# Altium schematic sheet QCLogic Rev A Sht2 WiFi.SchDoc
size A4
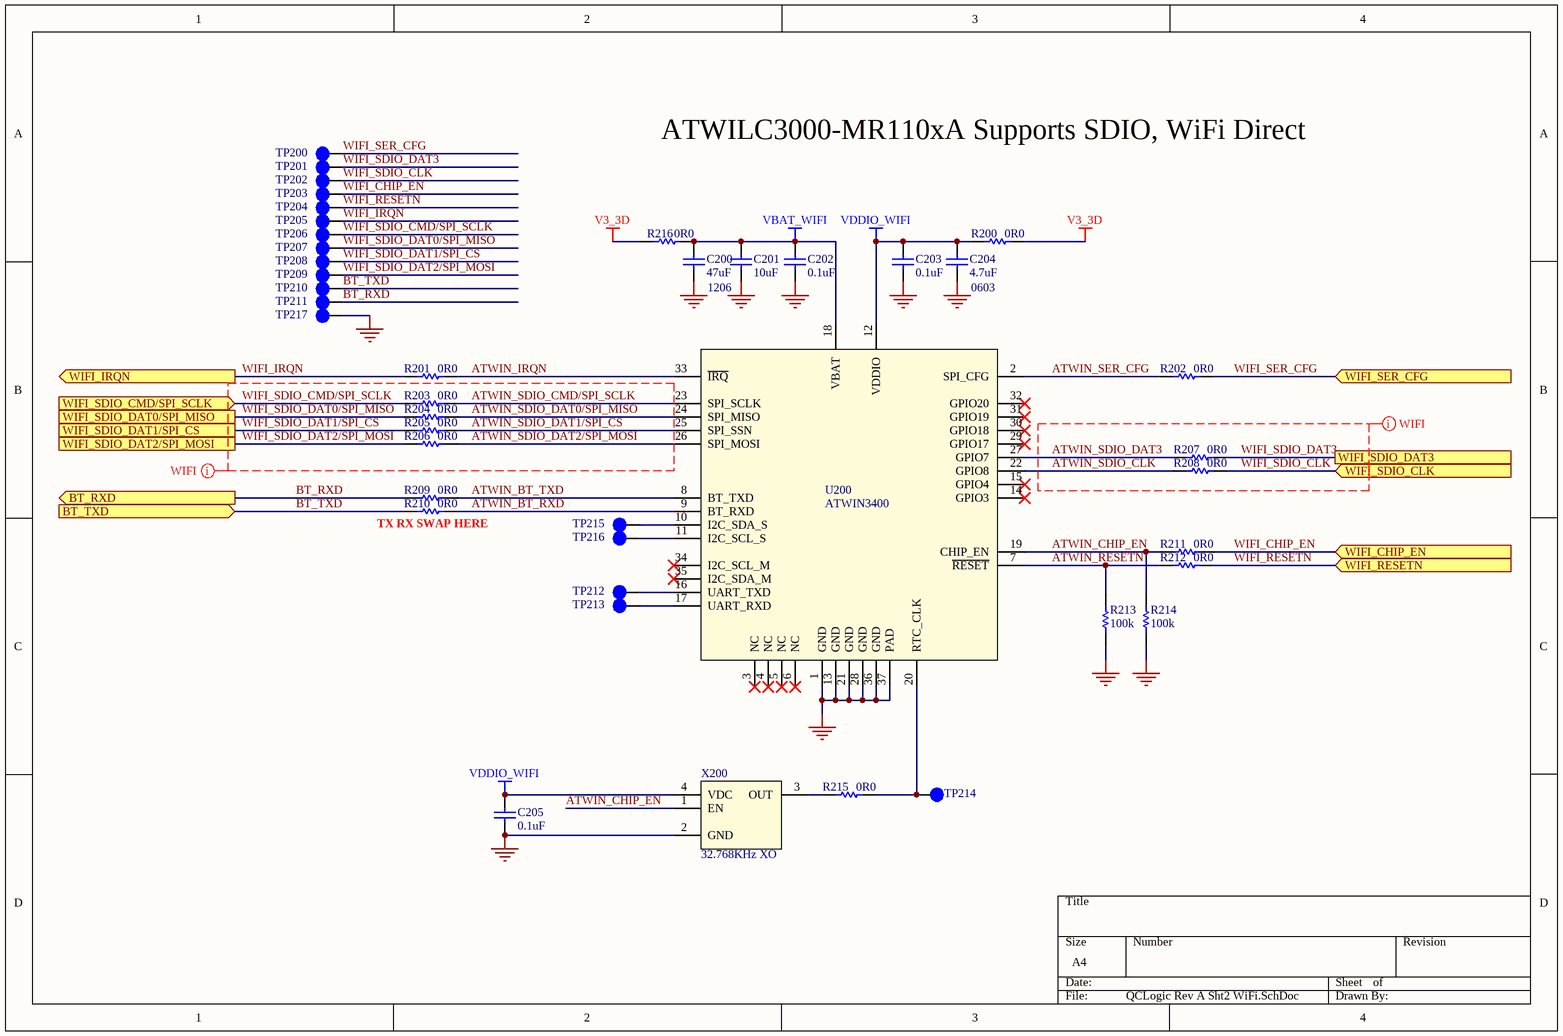
[diagram p0: QCLogic Rev A Sht2 WiFi.SchDoc]

## Parts
C200  47uF  4. Package: 1206  [SMD CAP 1206]
C201  10uF  [SMD CAP 0805]
C202  0.1uF  [SMD CAP 0402]
C203  0.1uF  [SMD CAP 0402]
C204  4.7uF  4. Package: 0603  [SMD CAP 0603]
C205  0.1uF  [SMD CAP 0402]
R200  0R0  [SMD RES 0402]
R201  0R0  [SMD RES 0402]
R202  0R0  [SMD RES 0402]
R203  0R0  [SMD RES 0402]
R204  0R0  [SMD RES 0402]
R205  0R0  [SMD RES 0402]
R206  0R0  [SMD RES 0402]
R207  0R0  [SMD RES 0402]
R208  0R0  [SMD RES 0402]
R209  0R0  [SMD RES 0402]
R210  0R0  [SMD RES 0402]
R211  0R0  [SMD RES 0402]
R212  0R0  [SMD RES 0402]
R213  100k  [SMD RES 0402]
R214  100k  [SMD RES 0402]
R215  0R0  [SMD RES 0402]
R216  0R0  [SMD RES 0402]
TP200  TESTPOINT SMD  [TESTPOINT 0.5mm DIA]  (value not drawn)  (no BOM)
TP201  TESTPOINT SMD  [TESTPOINT 0.5mm DIA]  (value not drawn)  (no BOM)
TP202  TESTPOINT SMD  [TESTPOINT 0.5mm DIA]  (value not drawn)  (no BOM)
TP203  TESTPOINT SMD  [TESTPOINT 0.5mm DIA]  (value not drawn)  (no BOM)
TP204  TESTPOINT SMD  [TESTPOINT 0.5mm DIA]  (value not drawn)  (no BOM)
TP205  TESTPOINT SMD  [TESTPOINT 0.5mm DIA]  (value not drawn)  (no BOM)
TP206  TESTPOINT SMD  [TESTPOINT 0.5mm DIA]  (value not drawn)  (no BOM)
TP207  TESTPOINT SMD  [TESTPOINT 0.5mm DIA]  (value not drawn)  (no BOM)
TP208  TESTPOINT SMD  [TESTPOINT 0.5mm DIA]  (value not drawn)  (no BOM)
TP209  TESTPOINT SMD  [TESTPOINT 0.5mm DIA]  (value not drawn)  (no BOM)
TP210  TESTPOINT SMD  [TESTPOINT 0.5mm DIA]  (value not drawn)  (no BOM)
TP211  TESTPOINT SMD  [TESTPOINT 0.5mm DIA]  (value not drawn)  (no BOM)
TP212  TESTPOINT SMD  [TESTPOINT 0.5mm DIA]  (value not drawn)  (no BOM)
TP213  TESTPOINT SMD  [TESTPOINT 0.5mm DIA]  (value not drawn)  (no BOM)
TP214  TESTPOINT SMD  [TESTPOINT 0.5mm DIA]  (value not drawn)  (no BOM)
TP215  TESTPOINT SMD  [TESTPOINT 0.5mm DIA]  (value not drawn)  (no BOM)
TP216  TESTPOINT SMD  [TESTPOINT 0.5mm DIA]  (value not drawn)  (no BOM)
TP217  TESTPOINT SMD  [TESTPOINT 1mm DIA]  (value not drawn)  (no BOM)
U200  ATWIN3400  [ATWINC3400-MR210CA]
X200  32.768KHz XO  [XTAL OSC 32.768K CMOS]

## Ports
BT_RXD (out), BT_TXD (in), WIFI_CHIP_EN (in), WIFI_IRQN (out), WIFI_RESETN (in), WIFI_SDIO_CLK (in), WIFI_SDIO_CMD/SPI_SCLK (in), WIFI_SDIO_DAT0/SPI_MISO, WIFI_SDIO_DAT1/SPI_CS, WIFI_SDIO_DAT2/SPI_MOSI, WIFI_SDIO_DAT3, WIFI_SER_CFG (in)

## Nets
GND: C200.2 C201.2 C202.1 C203.1 C204.2 C205.1 R213.2 R214.2 TP217.1 U200.1(GND) U200.13(GND) U200.21(GND) U200.28(GND) U200.36(GND) U200.37(PAD) X200.2(GND)
V3_3D: R200.2 R216.1
VBAT_WIFI: C200.1 C201.1 C202.2 R216.2 U200.18(VBAT)
VDDIO_WIFI: C203.2 C204.1 C205.2 R200.1 U200.12(VDDIO) X200.4(VDC)
ATWIN_BT_RXD: R210.2 U200.9(BT_RXD)
ATWIN_BT_TXD: R209.2 U200.8(BT_TXD)
ATWIN_CHIP_EN: R211.1 R214.1 U200.19(CHIP_EN) X200.1(EN)
ATWIN_IRQN: R201.2 U200.33(~{IRQ})
ATWIN_RESETN: R212.1 R213.1 U200.7(~{RESET})
ATWIN_SDIO_CLK: R208.1 U200.22(GPIO8)
ATWIN_SDIO_CMD/SPI_SCLK: R203.2 U200.23(SPI_SCLK)
ATWIN_SDIO_DAT0/SPI_MISO: R204.2 U200.24(SPI_MISO)
ATWIN_SDIO_DAT1/SPI_CS: R205.2 U200.25(SPI_SSN)
ATWIN_SDIO_DAT2/SPI_MOSI: R206.2 U200.26(SPI_MOSI)
ATWIN_SDIO_DAT3: R207.1 U200.27(GPIO7)
ATWIN_SER_CFG: R202.1 U200.2(SPI_CFG)
BT_RXD: R209.1 TP211.1 ; port BT_RXD
BT_TXD: R210.1 TP210.1 ; port BT_TXD
WIFI_CHIP_EN: R211.2 TP203.1 ; port WIFI_CHIP_EN
WIFI_IRQN: R201.1 TP205.1 ; port WIFI_IRQN
WIFI_RESETN: R212.2 TP204.1 ; port WIFI_RESETN
WIFI_SDIO_CLK: R208.2 TP202.1 ; port WIFI_SDIO_CLK
WIFI_SDIO_CMD/SPI_SCLK: R203.1 TP206.1 ; port WIFI_SDIO_CMD/SPI_SCLK
WIFI_SDIO_DAT0/SPI_MISO: R204.1 TP207.1 ; port WIFI_SDIO_DAT0/SPI_MISO
WIFI_SDIO_DAT1/SPI_CS: R205.1 TP208.1 ; port WIFI_SDIO_DAT1/SPI_CS
WIFI_SDIO_DAT2/SPI_MOSI: R206.1 TP209.1 ; port WIFI_SDIO_DAT2/SPI_MOSI
WIFI_SDIO_DAT3: R207.2 TP201.1 ; port WIFI_SDIO_DAT3
WIFI_SER_CFG: R202.2 TP200.1 ; port WIFI_SER_CFG
NetR215_1: R215.1 X200.3(OUT)
NetR215_2: R215.2 TP214.1 U200.20(RTC_CLK)
NetTP212_1: TP212.1 U200.16(UART_TXD)
NetTP213_1: TP213.1 U200.17(UART_RXD)
NetTP215_1: TP215.1 U200.10(I2C_SDA_S)
NetTP216_1: TP216.1 U200.11(I2C_SCL_S)

Not connected (* = marked no-connect by the designer): U200 3(NC)* 4(NC)* 5(NC)* 6(NC)* 14(GPIO3)* 15(GPIO4)* 29(GPIO17)* 30(GPIO18)* 31(GPIO19)* 32(GPIO20)* 34(I2C_SCL_M)* 35(I2C_SDA_M)*

## Layout directives
net class WIFI: ATWIN_SDIO_CLK, ATWIN_SDIO_CMD/SPI_SCLK, ATWIN_SDIO_DAT0/SPI_MISO, ATWIN_SDIO_DAT1/SPI_CS, ATWIN_SDIO_DAT2/SPI_MOSI, ATWIN_SDIO_DAT3, WIFI_SDIO_CLK, WIFI_SDIO_CMD/SPI_SCLK, WIFI_SDIO_DAT0/SPI_MISO, WIFI_SDIO_DAT1/SPI_CS, WIFI_SDIO_DAT2/SPI_MOSI, WIFI_SDIO_DAT3

## Notes on the sheet
- ATWILC3000-MR110xA Supports SDIO, WiFi Direct
- (near R210) TX RX SWAP HERE

## Library data of the parts
C200 = CAP MLCC SMD: CAP CER 47UF 10V X5R 1206; 1. Manufacturer: Samsung Electro-Mechanics; 2. Manufacturer Part Number: CL31A476MPHNNNE; 3. Date Modified: 20201128
C201 = CAP MLCC SMD: CAP CER 10UF 25V X5R 0805; 1. Manufacturer: Taiyo Yuden; 2. Manufacturer Part Number: TMK212BBJ106KG-T; 4. Package: 0805; 3. Date Modified: 20201128
C202 C203 C205 = CAP MLCC SMD: CAP CER 0.1UF 25V X7R 0402; 1. Manufacturer: Yageo; 2. Manufacturer Part Number: CC0402KRX7R8BB104; 4. Package: 0402; 3. Date Modified: 20201122
C204 = CAP MLCC SMD: CAP CER 4.7UF 16V X7S 0603; 1. Manufacturer: Murata Electronics; 2. Manufacturer Part Number: GRM188C71C475KE21D; 3. Date Modified: 20200906
R200-R212 R215 R216 = RES SMD: RES SMD 0 OHM JUMPER 1/16W 0402; 1. Manufacturer: Yageo; 2. Manufacturer Part Number: RC0402FR-070RL; 4. Package: 0402; 3. Date Modified: 20201122
R213 R214 = RES SMD: RES SMD 100K OHM 1% 1/16W 0402; 1. Manufacturer: Yageo; 2. Manufacturer Part Number: RC0402FR-07100KL; 4. Package: 0402; 3. Date Modified: 20201126
TP200-TP217 = TESTPOINT PAD: TESTPOINT SMD PAD; 1. Manufacturer: *; 2. Manufacturer Part Number: *; 3. Date Modified: *
U200 = MODULE WIFI 802_11BGN CHIP SMD: Bluetooth, WiFi 802.11b/g/n, Bluetooth v5.0 Transceiver Module 2.412GHz ~ 2.472GHz Integrated, Chip Surface Mount; 1. Manufacturer: Microchip Technology; 2. Manufacturer Part Number: ATWINC3400-MR210CA131-T; 3. Date Modified: 20201122
X200 = OSC XO 32.768KHZ HCMOS SMD: 1. Manufacturer: Jauch Quartz; 2. Manufacturer Part Number: O 0,032768-JO32-G-1V3-1-T1-LF; 3. Date Modified: 20201122